# Altium schematic sheet TMP100NA_temp_sensor.SchDoc
size A4; Organization: Altium Limited; Address1: L3, 12a Rodborough Rd; Address2: Frenchs Forest; Address3: NSW; Address4: Australia 2086
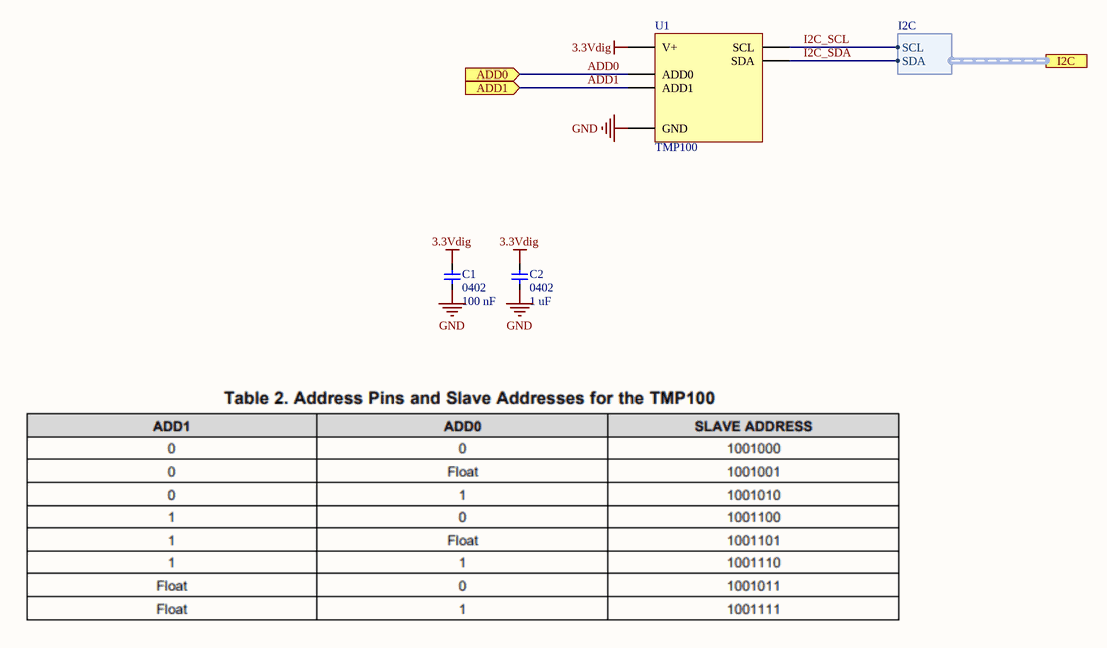
[diagram p0: TMP100NA_temp_sensor.SchDoc]

## Parts
C1  0402  value 100 nF  [CAPCERSMD0402]
C2  0402  value 1 uF  [CAPCERSMD0402]
U1  TMP100  [SOT6_P95W280L290H145]

## Ports
ADD0 (in), ADD1 (in), I2C (harness I2C)

## Harnesses
I2C: SCL, SDA

## Nets
3.3Vdig: C1.2 C2.2 U1.4(V+)
GND: C1.1 C2.1 U1.2(GND)
ADD0: U1.5(ADD0) ; port ADD0
ADD1: U1.3(ADD1) ; port ADD1
I2C_SCL: U1.1(SCL) ; port I2C.SCL
I2C_SDA: U1.6(SDA) ; port I2C.SDA

## Notes on the sheet
- Project Name:
- Revision:
- File Name:
- Date:
- Nuclear Instruments srl
- Via Lecco, 16, Lambrugo, Italy
- +39 031 2289570
- info@nuclearinstruments.eu
- http://www.nuclearinstruments.eu

## Library data of the parts
C1 = CAPCER0402_X7R_50V_100n
C2 = CAPCER0402_X5R_10V_1u
U1 = TMP100NA/250